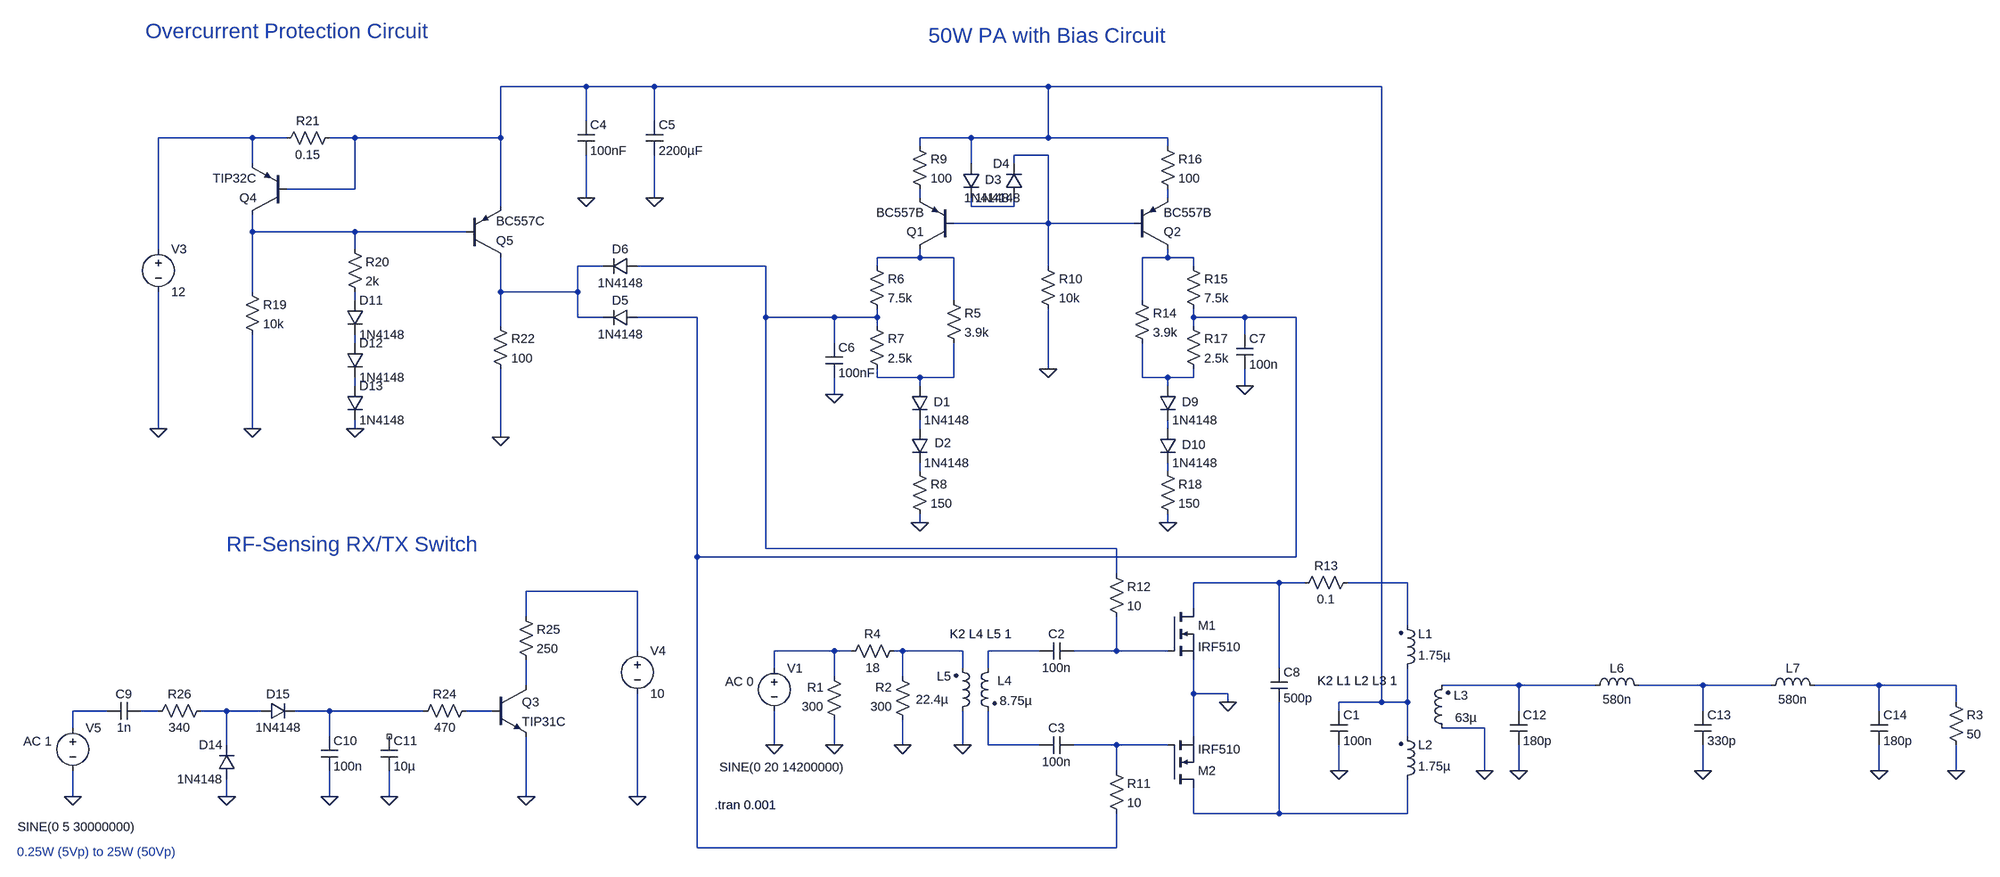
[diagram p0: schematic 50W PA with OCP.asc]
50W PA with OCP.asc, the LTspice schematic file:
Version 4
SHEET 1 1828 1816
WIRE -944 -880 -1104 -880
WIRE -816 -880 -944 -880
WIRE -80 -880 -816 -880
WIRE 544 -880 -80 -880
WIRE -944 -816 -944 -880
WIRE -816 -816 -816 -880
WIRE -1568 -784 -1744 -784
WIRE -1504 -784 -1568 -784
WIRE -1376 -784 -1424 -784
WIRE -1104 -784 -1104 -880
WIRE -1104 -784 -1376 -784
WIRE -224 -784 -320 -784
WIRE -80 -784 -80 -880
WIRE -80 -784 -224 -784
WIRE 144 -784 -80 -784
WIRE -320 -768 -320 -784
WIRE 144 -768 144 -784
WIRE -80 -752 -144 -752
WIRE -1568 -736 -1568 -784
WIRE -224 -736 -224 -784
WIRE -144 -736 -144 -752
WIRE -1376 -688 -1376 -784
WIRE -1376 -688 -1504 -688
WIRE -944 -672 -944 -752
WIRE -816 -672 -816 -752
WIRE -320 -672 -320 -688
WIRE 144 -672 144 -688
WIRE -1104 -656 -1104 -784
WIRE -224 -656 -224 -672
WIRE -144 -656 -144 -672
WIRE -144 -656 -224 -656
WIRE -80 -624 -80 -752
WIRE -80 -624 -256 -624
WIRE 80 -624 -80 -624
WIRE -1568 -608 -1568 -640
WIRE -1376 -608 -1568 -608
WIRE -1168 -608 -1376 -608
WIRE -1744 -576 -1744 -784
WIRE -1376 -576 -1376 -608
WIRE -320 -560 -320 -576
WIRE -320 -560 -400 -560
WIRE -256 -560 -320 -560
WIRE 144 -560 144 -576
WIRE 144 -560 96 -560
WIRE 192 -560 144 -560
WIRE -912 -544 -960 -544
WIRE -608 -544 -848 -544
WIRE -400 -544 -400 -560
WIRE -80 -544 -80 -624
WIRE 192 -544 192 -560
WIRE -1568 -496 -1568 -608
WIRE -1104 -496 -1104 -560
WIRE -960 -496 -960 -544
WIRE -960 -496 -1104 -496
WIRE -1376 -480 -1376 -496
WIRE -256 -480 -256 -560
WIRE 96 -480 96 -560
WIRE -960 -448 -960 -496
WIRE -912 -448 -960 -448
WIRE -736 -448 -848 -448
WIRE -608 -448 -608 -544
WIRE -480 -448 -608 -448
WIRE -400 -448 -400 -464
WIRE -400 -448 -480 -448
WIRE 192 -448 192 -464
WIRE 288 -448 192 -448
WIRE 384 -448 288 -448
WIRE -1104 -432 -1104 -496
WIRE -400 -432 -400 -448
WIRE 192 -432 192 -448
WIRE 288 -416 288 -448
WIRE -1376 -400 -1376 -416
WIRE -480 -400 -480 -448
WIRE -80 -352 -80 -464
WIRE -400 -336 -400 -352
WIRE -320 -336 -400 -336
WIRE -256 -336 -256 -400
WIRE -256 -336 -320 -336
WIRE 96 -336 96 -400
WIRE 144 -336 96 -336
WIRE 192 -336 192 -352
WIRE 192 -336 144 -336
WIRE -1376 -320 -1376 -336
WIRE -320 -320 -320 -336
WIRE 144 -320 144 -336
WIRE 288 -320 288 -352
WIRE -480 -304 -480 -336
WIRE -1744 -240 -1744 -496
WIRE -1568 -240 -1568 -416
WIRE -1376 -240 -1376 -256
WIRE -320 -240 -320 -256
WIRE 144 -240 144 -256
WIRE -1104 -224 -1104 -352
WIRE -320 -160 -320 -176
WIRE 144 -160 144 -176
WIRE -320 -64 -320 -80
WIRE 144 -64 144 -80
WIRE -608 -16 -608 -448
WIRE 48 -16 -608 -16
WIRE -736 0 -736 -448
WIRE 384 0 384 -448
WIRE 384 0 -736 0
WIRE 48 32 48 -16
WIRE 352 48 192 48
WIRE 400 48 352 48
WIRE 592 48 480 48
WIRE -848 64 -1056 64
WIRE 192 96 192 48
WIRE -1056 112 -1056 64
WIRE 592 128 592 48
WIRE -848 176 -848 64
WIRE -480 176 -592 176
WIRE -448 176 -480 176
WIRE -352 176 -368 176
WIRE -240 176 -352 176
WIRE -96 176 -192 176
WIRE 48 176 48 112
WIRE 48 176 -32 176
WIRE 144 176 48 176
WIRE -592 208 -592 176
WIRE -240 208 -240 176
WIRE -192 208 -192 176
WIRE 352 208 352 48
WIRE -480 224 -480 176
WIRE -352 224 -352 176
WIRE -1056 240 -1056 192
WIRE 800 240 656 240
WIRE 944 240 800 240
WIRE 1168 240 1024 240
WIRE 1296 240 1168 240
WIRE 1504 240 1376 240
WIRE 1648 240 1504 240
WIRE 192 256 192 192
WIRE 256 256 192 256
WIRE 256 272 256 256
WIRE 544 272 544 -880
WIRE 544 272 464 272
WIRE 592 272 592 208
WIRE 592 272 544 272
WIRE 1648 272 1648 240
WIRE -1840 288 -1904 288
WIRE -1744 288 -1776 288
WIRE -1616 288 -1664 288
WIRE -1552 288 -1616 288
WIRE -1424 288 -1488 288
WIRE -1248 288 -1424 288
WIRE -1120 288 -1168 288
WIRE 464 288 464 272
WIRE 800 288 800 240
WIRE 1168 288 1168 240
WIRE 1504 288 1504 240
WIRE -1904 320 -1904 288
WIRE 736 320 656 320
WIRE -1424 336 -1424 288
WIRE 192 336 192 256
WIRE 592 336 592 272
WIRE -1616 352 -1616 288
WIRE -592 352 -592 288
WIRE -480 352 -480 304
WIRE -352 352 -352 304
WIRE -240 352 -240 288
WIRE -192 352 -192 288
WIRE -96 352 -192 352
WIRE 48 352 -32 352
WIRE 144 352 48 352
WIRE 48 400 48 352
WIRE 464 400 464 352
WIRE 736 400 736 320
WIRE 800 400 800 352
WIRE 1168 400 1168 352
WIRE 1504 400 1504 352
WIRE 1648 400 1648 352
WIRE -1904 448 -1904 400
WIRE -1616 448 -1616 416
WIRE -1424 448 -1424 400
WIRE -1312 448 -1312 400
WIRE -1056 448 -1056 336
WIRE -848 448 -848 256
WIRE 192 480 192 432
WIRE 352 480 352 272
WIRE 352 480 192 480
WIRE 592 480 592 416
WIRE 592 480 352 480
WIRE -736 544 -736 0
WIRE 48 544 48 480
WIRE 48 544 -736 544
FLAG 256 272 0
FLAG 464 400 0
FLAG -240 352 0
FLAG -592 352 0
FLAG -320 -64 0
FLAG -480 -304 0
FLAG -80 -352 0
FLAG 288 -320 0
FLAG 144 -64 0
FLAG 736 400 0
FLAG -480 352 0
FLAG -352 352 0
FLAG -1376 -240 0
FLAG -1568 -240 0
FLAG -1104 -224 0
FLAG -1744 -240 0
FLAG -1056 448 0
FLAG -848 448 0
FLAG -1904 448 0
FLAG -1424 448 0
FLAG -1616 448 0
FLAG -1312 448 0
FLAG 800 400 0
FLAG 1648 400 0
FLAG 1168 400 0
FLAG 1504 400 0
FLAG -944 -672 0
FLAG -816 -672 0
SYMBOL nmos 144 96 R0
SYMATTR InstName M1
SYMATTR Value IRF510
SYMBOL nmos 144 432 M180
SYMATTR InstName M2
SYMATTR Value IRF510
SYMBOL ind2 576 224 M180
WINDOW 0 36 80 Left 2
WINDOW 3 36 40 Left 2
SYMATTR InstName L1
SYMATTR Value 1.75µ
SYMATTR Type ind
SYMBOL ind2 576 432 M180
WINDOW 0 36 80 Left 2
WINDOW 3 36 40 Left 2
SYMATTR InstName L2
SYMATTR Value 1.75µ
SYMATTR Type ind
SYMBOL ind2 672 336 R180
WINDOW 0 -34 77 Left 2
WINDOW 3 -50 35 Left 2
SYMATTR InstName L3
SYMATTR Value 63µ
SYMATTR Type ind
SYMBOL cap 448 288 R0
SYMATTR InstName C1
SYMATTR Value 100n
SYMBOL cap -32 160 R90
WINDOW 0 0 32 VBottom 2
WINDOW 3 32 32 VTop 2
SYMATTR InstName C2
SYMATTR Value 100n
SYMBOL cap -32 336 R90
WINDOW 0 0 32 VBottom 2
WINDOW 3 32 32 VTop 2
SYMATTR InstName C3
SYMATTR Value 100n
SYMBOL ind2 -176 192 M0
WINDOW 0 -28 40 Left 2
WINDOW 3 -66 77 Left 2
SYMATTR InstName L4
SYMATTR Value 8.75µ
SYMATTR Type ind
SYMBOL ind2 -256 304 M180
WINDOW 0 -32 81 Left 2
WINDOW 3 -71 37 Left 2
SYMATTR InstName L5
SYMATTR Value 22.4µ
SYMATTR Type ind
SYMBOL voltage -592 192 R0
WINDOW 3 -103 201 Left 2
WINDOW 123 -92 41 Left 2
WINDOW 39 0 0 Left 2
SYMATTR Value SINE(0 20 14200000)
SYMATTR Value2 AC 0
SYMATTR InstName V1
SYMBOL res -352 160 R90
WINDOW 0 0 56 VBottom 2
WINDOW 3 32 56 VTop 2
SYMATTR InstName R4
SYMATTR Value 18
SYMBOL diode -336 -320 R0
WINDOW 0 42 30 Left 2
SYMATTR InstName D1
SYMATTR Value 1N4148
SYMBOL pnp -256 -576 R180
SYMATTR InstName Q1
SYMATTR Value BC557B
SYMBOL res -272 -496 R0
SYMATTR InstName R5
SYMATTR Value 3.9k
SYMBOL res -416 -560 R0
SYMATTR InstName R6
SYMATTR Value 7.5k
SYMBOL res -416 -448 R0
SYMATTR InstName R7
SYMATTR Value 2.5k
SYMBOL diode -336 -240 R0
WINDOW 0 44 27 Left 2
SYMATTR InstName D2
SYMATTR Value 1N4148
SYMBOL res -336 -176 R0
SYMATTR InstName R8
SYMATTR Value 150
SYMBOL cap -496 -400 R0
SYMATTR InstName C6
SYMATTR Value 100nF
SYMBOL res -336 -784 R0
SYMATTR InstName R9
SYMATTR Value 100
SYMBOL diode -240 -736 R0
WINDOW 0 42 30 Left 2
SYMATTR InstName D3
SYMATTR Value 1N4148
SYMBOL diode -128 -672 R180
WINDOW 0 24 64 Left 2
WINDOW 3 24 0 Left 2
SYMATTR InstName D4
SYMATTR Value 1N4148
SYMBOL res -96 -560 R0
SYMATTR InstName R10
SYMATTR Value 10k
SYMBOL res 32 384 R0
SYMATTR InstName R11
SYMATTR Value 10
SYMBOL res 32 16 R0
SYMATTR InstName R12
SYMATTR Value 10
SYMBOL res 80 -496 R0
SYMATTR InstName R14
SYMATTR Value 3.9k
SYMBOL res 176 -560 R0
SYMATTR InstName R15
SYMATTR Value 7.5k
SYMBOL pnp 80 -576 M180
SYMATTR InstName Q2
SYMATTR Value BC557B
SYMBOL res 128 -784 R0
SYMATTR InstName R16
SYMATTR Value 100
SYMBOL res 176 -448 R0
SYMATTR InstName R17
SYMATTR Value 2.5k
SYMBOL cap 272 -416 R0
SYMATTR InstName C7
SYMATTR Value 100n
SYMBOL diode 128 -320 R0
WINDOW 0 42 30 Left 2
SYMATTR InstName D9
SYMATTR Value 1N4148
SYMBOL diode 128 -240 R0
WINDOW 0 42 30 Left 2
SYMATTR InstName D10
SYMATTR Value 1N4148
SYMBOL res 128 -176 R0
SYMATTR InstName R18
SYMATTR Value 150
SYMBOL cap 336 208 R0
SYMATTR InstName C8
SYMATTR Value 500p
SYMBOL res -464 320 R180
WINDOW 0 36 76 Left 2
WINDOW 3 36 40 Left 2
SYMATTR InstName R1
SYMATTR Value 300
SYMBOL res -336 320 R180
WINDOW 0 36 76 Left 2
WINDOW 3 36 40 Left 2
SYMATTR InstName R2
SYMATTR Value 300
SYMBOL npn -1120 240 R0
SYMATTR InstName Q3
SYMATTR Value TIP31C
SYMBOL pnp -1504 -640 R180
SYMATTR InstName Q4
SYMATTR Value TIP32C
SYMBOL pnp -1168 -560 M180
SYMATTR InstName Q5
SYMATTR Value BC557C
SYMBOL voltage -1744 -592 R0
WINDOW 123 0 0 Left 2
WINDOW 39 0 0 Left 2
SYMATTR InstName V3
SYMATTR Value 12
SYMBOL res -1584 -512 R0
SYMATTR InstName R19
SYMATTR Value 10k
SYMBOL res -1392 -592 R0
SYMATTR InstName R20
SYMATTR Value 2k
SYMBOL diode -1392 -480 R0
SYMATTR InstName D11
SYMATTR Value 1N4148
SYMBOL diode -1392 -400 R0
SYMATTR InstName D12
SYMATTR Value 1N4148
SYMBOL diode -1392 -320 R0
SYMATTR InstName D13
SYMATTR Value 1N4148
SYMBOL res -1408 -800 R90
WINDOW 0 0 56 VBottom 2
WINDOW 3 32 56 VTop 2
SYMATTR InstName R21
SYMATTR Value 0.15
SYMBOL res -1120 -448 R0
SYMATTR InstName R22
SYMATTR Value 100
SYMBOL res -1152 272 R90
WINDOW 0 0 56 VBottom 2
WINDOW 3 32 56 VTop 2
SYMATTR InstName R24
SYMATTR Value 470
SYMBOL voltage -848 160 R0
WINDOW 123 0 0 Left 2
WINDOW 39 0 0 Left 2
SYMATTR InstName V4
SYMATTR Value 10
SYMBOL res -1072 96 R0
SYMATTR InstName R25
SYMATTR Value 250
SYMBOL voltage -1904 304 R0
WINDOW 3 -103 201 Left 2
WINDOW 123 -92 41 Left 2
WINDOW 39 0 0 Left 2
SYMATTR Value SINE(0 5 30000000)
SYMATTR Value2 AC 1
SYMATTR InstName V5
SYMBOL cap -1776 272 R90
WINDOW 0 0 32 VBottom 2
WINDOW 3 32 32 VTop 2
SYMATTR InstName C9
SYMATTR Value 1n
SYMBOL res -1648 272 R90
WINDOW 0 0 56 VBottom 2
WINDOW 3 32 56 VTop 2
SYMATTR InstName R26
SYMATTR Value 340
SYMBOL diode -1600 416 R180
WINDOW 0 24 64 Left 2
WINDOW 3 24 0 Left 2
SYMATTR InstName D14
SYMATTR Value 1N4148
SYMBOL diode -1552 304 R270
WINDOW 0 32 32 VTop 2
WINDOW 3 0 32 VBottom 2
SYMATTR InstName D15
SYMATTR Value 1N4148
SYMBOL cap -1440 336 R0
SYMATTR InstName C10
SYMATTR Value 100n
SYMBOL cap -1328 336 R0
SYMATTR InstName C11
SYMATTR Value 10µ
SYMBOL cap 784 288 R0
SYMATTR InstName C12
SYMATTR Value 180p
SYMBOL cap 1152 288 R0
SYMATTR InstName C13
SYMATTR Value 330p
SYMBOL cap 1488 288 R0
SYMATTR InstName C14
SYMATTR Value 180p
SYMBOL ind 928 256 R270
WINDOW 0 32 56 VTop 2
WINDOW 3 5 56 VBottom 2
SYMATTR InstName L6
SYMATTR Value 580n
SYMBOL ind 1280 256 R270
WINDOW 0 32 56 VTop 2
WINDOW 3 5 56 VBottom 2
SYMATTR InstName L7
SYMATTR Value 580n
SYMBOL res 1632 256 R0
SYMATTR InstName R3
SYMATTR Value 50
SYMBOL diode -848 -464 R90
WINDOW 0 0 32 VBottom 2
WINDOW 3 32 32 VTop 2
SYMATTR InstName D5
SYMATTR Value 1N4148
SYMBOL diode -848 -560 R90
WINDOW 0 0 32 VBottom 2
WINDOW 3 32 32 VTop 2
SYMATTR InstName D6
SYMATTR Value 1N4148
SYMBOL res 496 32 R90
WINDOW 0 0 56 VBottom 2
WINDOW 3 32 56 VTop 2
SYMATTR InstName R13
SYMATTR Value 0.1
SYMBOL cap -960 -816 R0
SYMATTR InstName C4
SYMATTR Value 100nF
SYMBOL cap -832 -816 R0
SYMATTR InstName C5
SYMATTR Value 2200µF
TEXT 424 232 Left 2 !K2 L1 L2 L3 1
TEXT -264 144 Left 2 !K2 L4 L5 1
TEXT -704 464 Left 2 !.tran 0.001
TEXT -304 -976 Left 4 ;50W PA with Bias Circuit
TEXT -1616 -24 Left 4 ;RF-Sensing RX/TX Switch
TEXT -1768 -984 Left 4 ;Overcurrent Protection Circuit
TEXT -2008 552 Left 2 ;0.25W (5Vp) to 25W (50Vp)

The netlist it stands for:
* 50W PA with OCP.asc
M1 N022 N028 0 0 IRF510
M2 N040 N039 0 0 IRF510
L1 N001 N023 1.75µ
L2 N040 N001 1.75µ
L3 0 N030 63µ
C1 N001 0 100n
C2 N028 N027 100n
C3 N039 N038 100n
L4 N027 N038 8.75µ
L5 0 N026 22.4µ
V1 N025 0 SINE(0 20 14200000) AC 0
R4 N026 N025 18
D1 N015 N018 1N4148
Q1 N008 N003 N004 0 BC557B
R5 N008 N015 3.9k
R6 N008 N011 7.5k
R7 N011 N015 2.5k
D2 N018 N020 1N4148
R8 N020 0 150
C6 N011 0 100nF
R9 N001 N004 100
D3 N001 N006 1N4148
D4 N006 N003 1N4148
R10 N003 0 10k
R11 N039 N013 10
R12 N011 N028 10
R14 N009 N016 3.9k
R15 N009 N013 7.5k
Q2 N009 N003 N005 0 BC557B
R16 N001 N005 100
R17 N013 N016 2.5k
C7 N013 0 100n
D9 N016 N019 1N4148
D10 N019 N021 1N4148
R18 N021 0 150
C8 N022 N040 500p
R1 0 N025 300
R2 0 N026 300
Q3 N029 N037 0 0 TIP31C
Q4 N007 N001 N002 0 TIP32C
Q5 N010 N007 N001 0 BC557C
V3 N002 0 12
R19 N007 0 10k
R20 N007 N012 2k
D11 N012 N014 1N4148
D12 N014 N017 1N4148
D13 N017 0 1N4148
R21 N001 N002 0.15
R22 N010 0 100
R24 N037 N036 470
V4 N024 0 10
R25 N024 N029 250
V5 N033 0 SINE(0 5 30000000) AC 1
C9 N034 N033 1n
R26 N035 N034 340
D14 0 N035 1N4148
D15 N035 N036 1N4148
C10 N036 0 100n
C11 NC_01 0 10µ
C12 N030 0 180p
C13 N031 0 330p
C14 N032 0 180p
L6 N030 N031 580n
L7 N031 N032 580n
R3 N032 0 50
D5 N013 N010 1N4148
D6 N011 N010 1N4148
R13 N023 N022 0.1
C4 N001 0 100nF
C5 N001 0 2200µF
.model D D
.lib standard.dio
.model NPN NPN
.model PNP PNP
.lib standard.bjt
.model NMOS NMOS
.model PMOS PMOS
.lib standard.mos
K2 L1 L2 L3 1
K2 L4 L5 1
.tran 0.001
* 50W PA with Bias Circuit
* RF-Sensing RX/TX Switch
* Overcurrent Protection Circuit
* 0.25W (5Vp) to 25W (50Vp)
.backanno
.end